# Altium schematic sheet main.SchDoc: SigJumper-Top - Main
size Letter; CheckedBy: J. Brinton; CompanyName: Signal Laboratories, Inc.; DrawnBy: J. Brinton; Engineer: J. Brinton; Address1: 3479 Edison Way; Address2: Menlo Park CA 94025; Address3: +1 (877) 778-8435; Address4: siglabs.com; Revision: 2; SheetNumber: 1; SheetTotal: 4
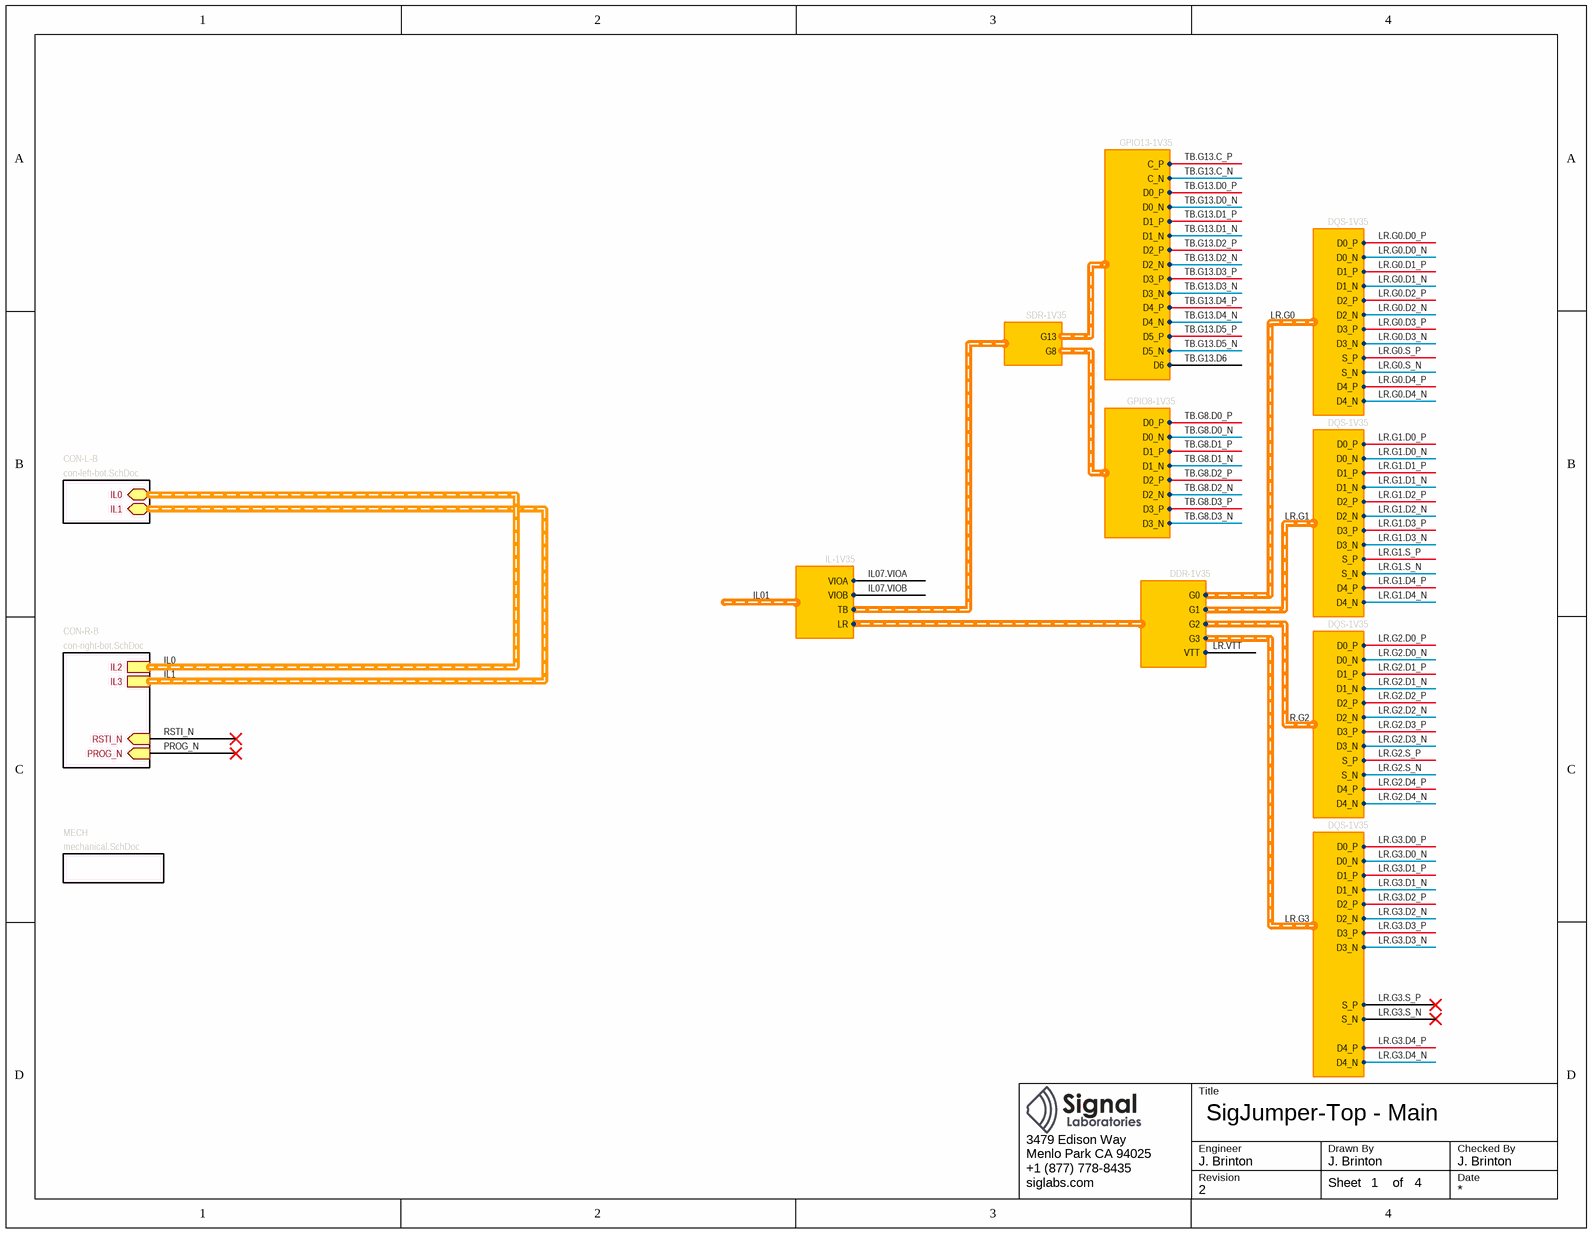
[diagram p0: main.SchDoc]

## Sub-sheets
CON-L-B = con-left-bot.SchDoc: IL0 (harness IL-1V35), IL1 (harness IL-1V35)
CON-R-B = con-right-bot.SchDoc: IL3 (harness IL-1V35), RSTI_N (in), PROG_N (in), IL2 (harness IL-1V35)
MECH = mechanical.SchDoc: no entries

## Harnesses
GPIO8-1V35: D0_P, D0_N, D1_P, D1_N, D2_P, D2_N, D3_P, D3_N
SDR-1V35: G13, G8
GPIO13-1V35: C_P, C_N, D0_P, D0_N, D1_P, D1_N, D2_P, D2_N, D3_P, D3_N, D4_P, D4_N, D5_P, D5_N, D6
DQS-1V35: D0_P, D0_N, D1_P, D1_N, D2_P, D2_N, D3_P, D3_N, D4_P, D4_N, S_P, S_N
DDR-1V35: G0, G1, G2, G3, VTT
IL-1V35: LR, TB, VIOA, VIOB

## Nets
IL07.VIOA: harness IL-1V35.VIOA  [project net IL01.VIOA]
IL07.VIOB: harness IL-1V35.VIOB  [project net IL01.VIOB]
LR.G0.D0_N: harness DQS-1V35.D0_N
LR.G0.D0_P: harness DQS-1V35.D0_P
LR.G0.D1_N: harness DQS-1V35.D1_N
LR.G0.D1_P: harness DQS-1V35.D1_P
LR.G0.D2_N: harness DQS-1V35.D2_N
LR.G0.D2_P: harness DQS-1V35.D2_P
LR.G0.D3_N: harness DQS-1V35.D3_N
LR.G0.D3_P: harness DQS-1V35.D3_P
LR.G0.D4_N: harness DQS-1V35.D4_N
LR.G0.D4_P: harness DQS-1V35.D4_P
LR.G0.S_N: harness DQS-1V35.S_N
LR.G0.S_P: harness DQS-1V35.S_P
LR.G1.D0_N: harness DQS-1V35.D0_N
LR.G1.D0_P: harness DQS-1V35.D0_P
LR.G1.D1_N: harness DQS-1V35.D1_N
LR.G1.D1_P: harness DQS-1V35.D1_P
LR.G1.D2_N: harness DQS-1V35.D2_N
LR.G1.D2_P: harness DQS-1V35.D2_P
LR.G1.D3_N: harness DQS-1V35.D3_N
LR.G1.D3_P: harness DQS-1V35.D3_P
LR.G1.D4_N: harness DQS-1V35.D4_N
LR.G1.D4_P: harness DQS-1V35.D4_P
LR.G1.S_N: harness DQS-1V35.S_N
LR.G1.S_P: harness DQS-1V35.S_P
LR.G2.D0_N: harness DQS-1V35.D0_N
LR.G2.D0_P: harness DQS-1V35.D0_P
LR.G2.D1_N: harness DQS-1V35.D1_N
LR.G2.D1_P: harness DQS-1V35.D1_P
LR.G2.D2_N: harness DQS-1V35.D2_N
LR.G2.D2_P: harness DQS-1V35.D2_P
LR.G2.D3_N: harness DQS-1V35.D3_N
LR.G2.D3_P: harness DQS-1V35.D3_P
LR.G2.D4_N: harness DQS-1V35.D4_N
LR.G2.D4_P: harness DQS-1V35.D4_P
LR.G2.S_N: harness DQS-1V35.S_N
LR.G2.S_P: harness DQS-1V35.S_P
LR.G3.D0_N: harness DQS-1V35.D0_N
LR.G3.D0_P: harness DQS-1V35.D0_P
LR.G3.D1_N: harness DQS-1V35.D1_N
LR.G3.D1_P: harness DQS-1V35.D1_P
LR.G3.D2_N: harness DQS-1V35.D2_N
LR.G3.D2_P: harness DQS-1V35.D2_P
LR.G3.D3_N: harness DQS-1V35.D3_N
LR.G3.D3_P: harness DQS-1V35.D3_P
LR.G3.D4_N: harness DQS-1V35.D4_N
LR.G3.D4_P: harness DQS-1V35.D4_P
LR.G3.S_N: harness DQS-1V35.S_N
LR.G3.S_P: harness DQS-1V35.S_P
LR.VTT: harness DDR-1V35.VTT
PROG_N: sheet CON-R-B/PROG_N
RSTI_N: sheet CON-R-B/RSTI_N
TB.G8.D0_N: harness GPIO8-1V35.D0_N
TB.G8.D0_P: harness GPIO8-1V35.D0_P
TB.G8.D1_N: harness GPIO8-1V35.D1_N
TB.G8.D1_P: harness GPIO8-1V35.D1_P
TB.G8.D2_N: harness GPIO8-1V35.D2_N
TB.G8.D2_P: harness GPIO8-1V35.D2_P
TB.G8.D3_N: harness GPIO8-1V35.D3_N
TB.G8.D3_P: harness GPIO8-1V35.D3_P
TB.G13.C_N: harness GPIO13-1V35.C_N
TB.G13.C_P: harness GPIO13-1V35.C_P
TB.G13.D0_N: harness GPIO13-1V35.D0_N
TB.G13.D0_P: harness GPIO13-1V35.D0_P
TB.G13.D1_N: harness GPIO13-1V35.D1_N
TB.G13.D1_P: harness GPIO13-1V35.D1_P
TB.G13.D2_N: harness GPIO13-1V35.D2_N
TB.G13.D2_P: harness GPIO13-1V35.D2_P
TB.G13.D3_N: harness GPIO13-1V35.D3_N
TB.G13.D3_P: harness GPIO13-1V35.D3_P
TB.G13.D4_N: harness GPIO13-1V35.D4_N
TB.G13.D4_P: harness GPIO13-1V35.D4_P
TB.G13.D5_N: harness GPIO13-1V35.D5_N
TB.G13.D5_P: harness GPIO13-1V35.D5_P
TB.G13.D6: harness GPIO13-1V35.D6

## Buses and harness runs
harness IL0 = sheet CON-L-B/IL0 = sheet CON-R-B/IL2
harness IL1 = sheet CON-L-B/IL1 = sheet CON-R-B/IL3

## Notes on the sheet
- Title
- Engineer
- Revision
- Drawn By
- Checked By
- Date
- Sheet
- of